# Altium schematic sheet 2 Cell Battery Case.schdoc
size 124 x 99 mm
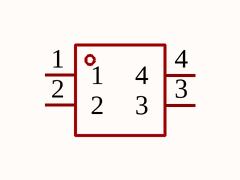
[diagram p0: 2 Cell Battery Case.schdoc]

## Parts
BAT?  BH-18650-A1BJ021  [BAT-TH_L77.0-W39.9_BH-18650-A1BJ021]  (value not drawn)

## Nets

Not connected (* = marked no-connect by the designer): BAT? 1 2 3 4

## Library data of the parts
BAT? = BH-18650-A1BJ021: Manufacturer: MYOUNG(美阳); Add into BOM: yes; Connector Type: Battery box; Battery Type: CR18650; Symbol: BH-18650-A1BJ021; Device: BH-18650-A1BJ021; LCSC Part Name: 电池盒 适用电池:CR18650; Supplier Part: C20606804; Manufacturer Part: BH-18650-A1BJ021; Supplier Footprint: 插件; JLCPCB Part Class: Extended Part; Datasheet: https://atta.szlcsc.com/upload/public/pdf/source/20240112/147D77B47FAFC966051AFF7CD950677D.pdf; Supplier: LCSC; Convert to PCB: yes; Contact Plating: Nickel; Operating Temperature Range: -25℃~+85℃